# Altium project Chassis_Controller_f407zgt6.PrjPcb
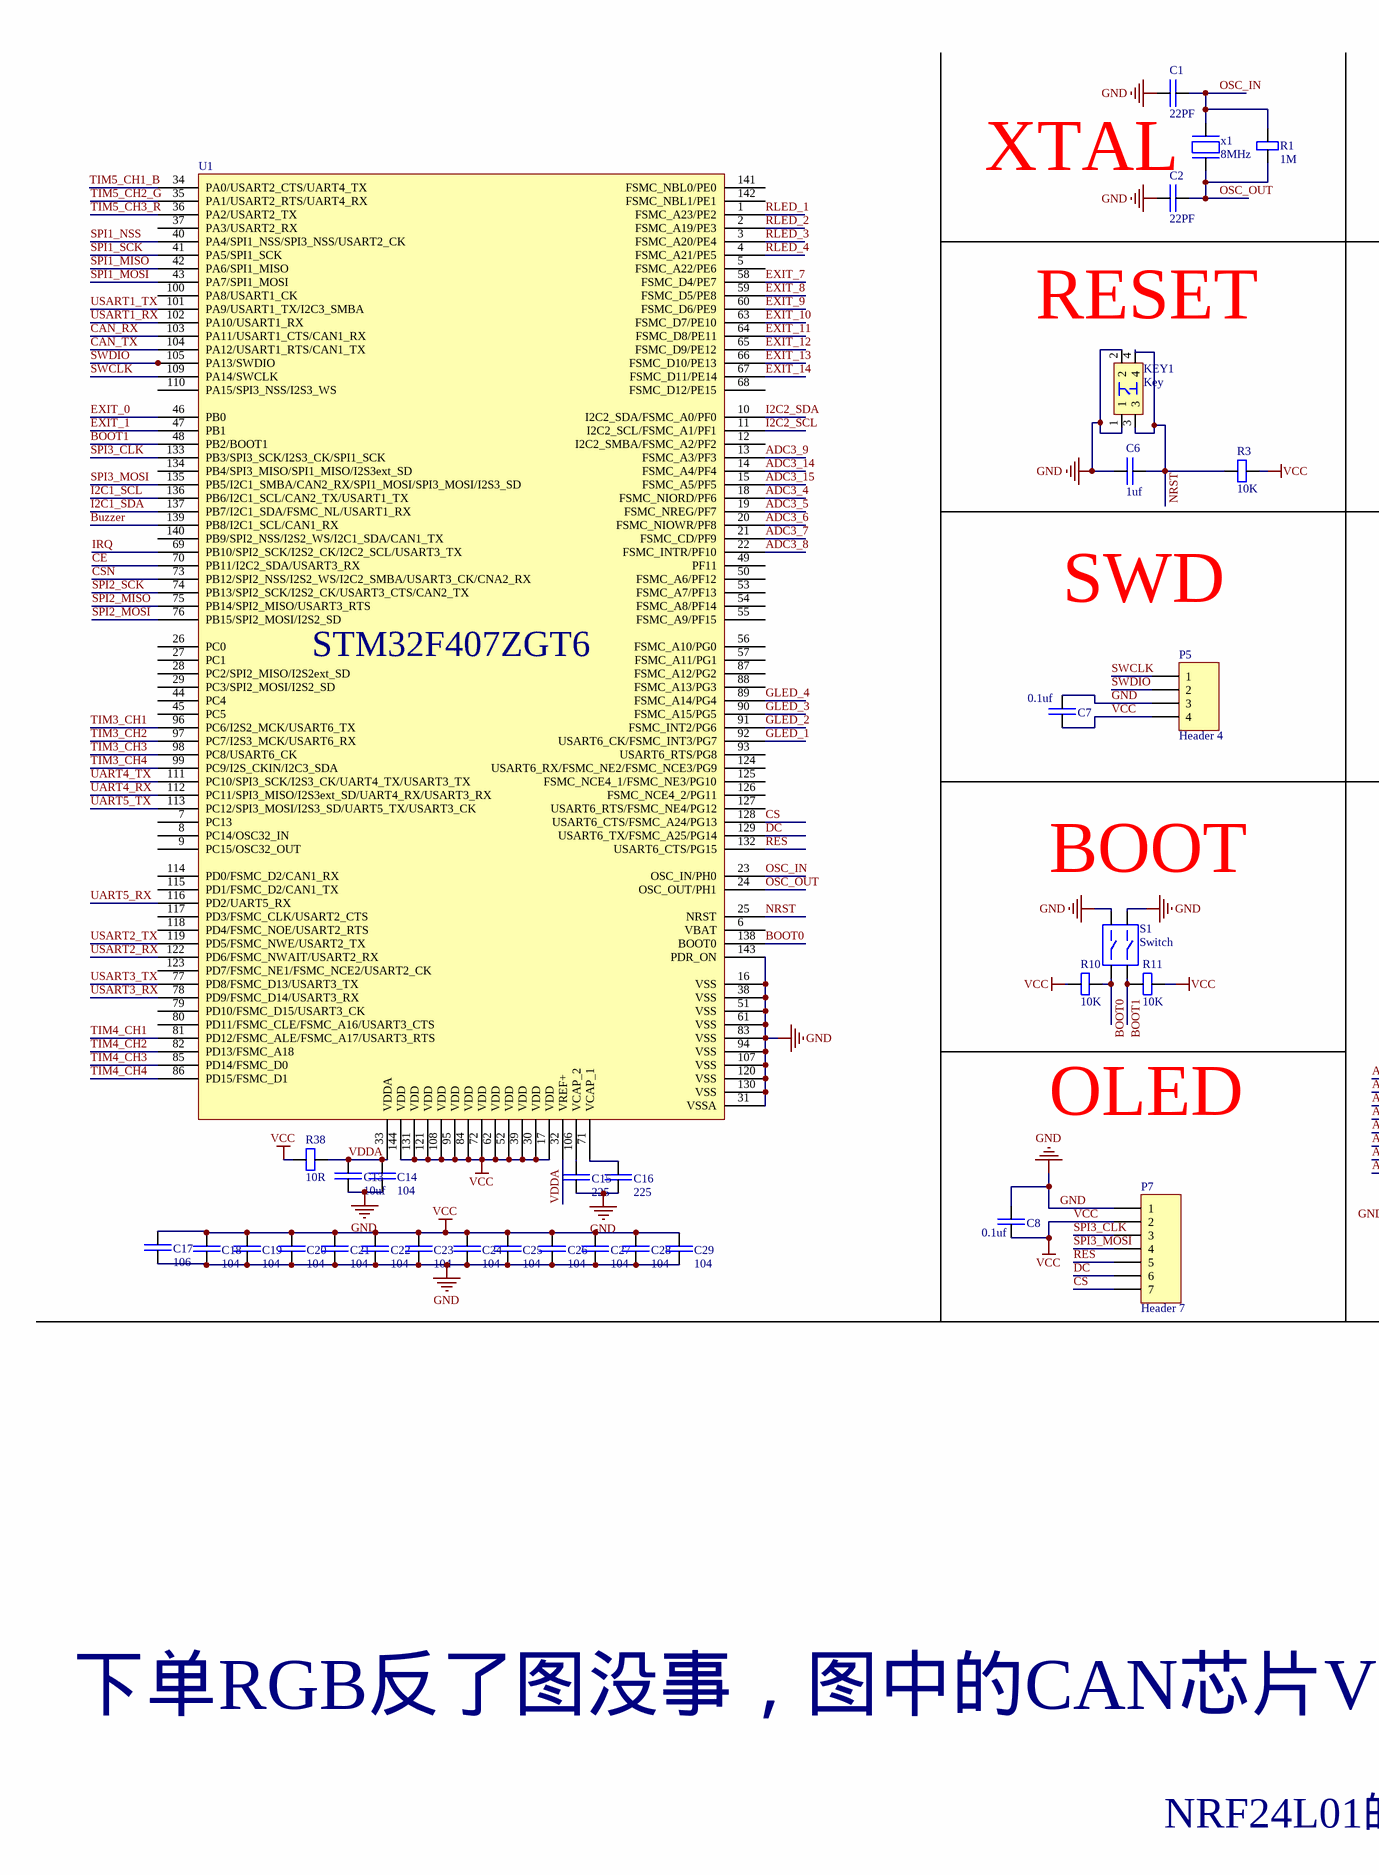
[diagram p0: Sheet1.SchDoc, left]
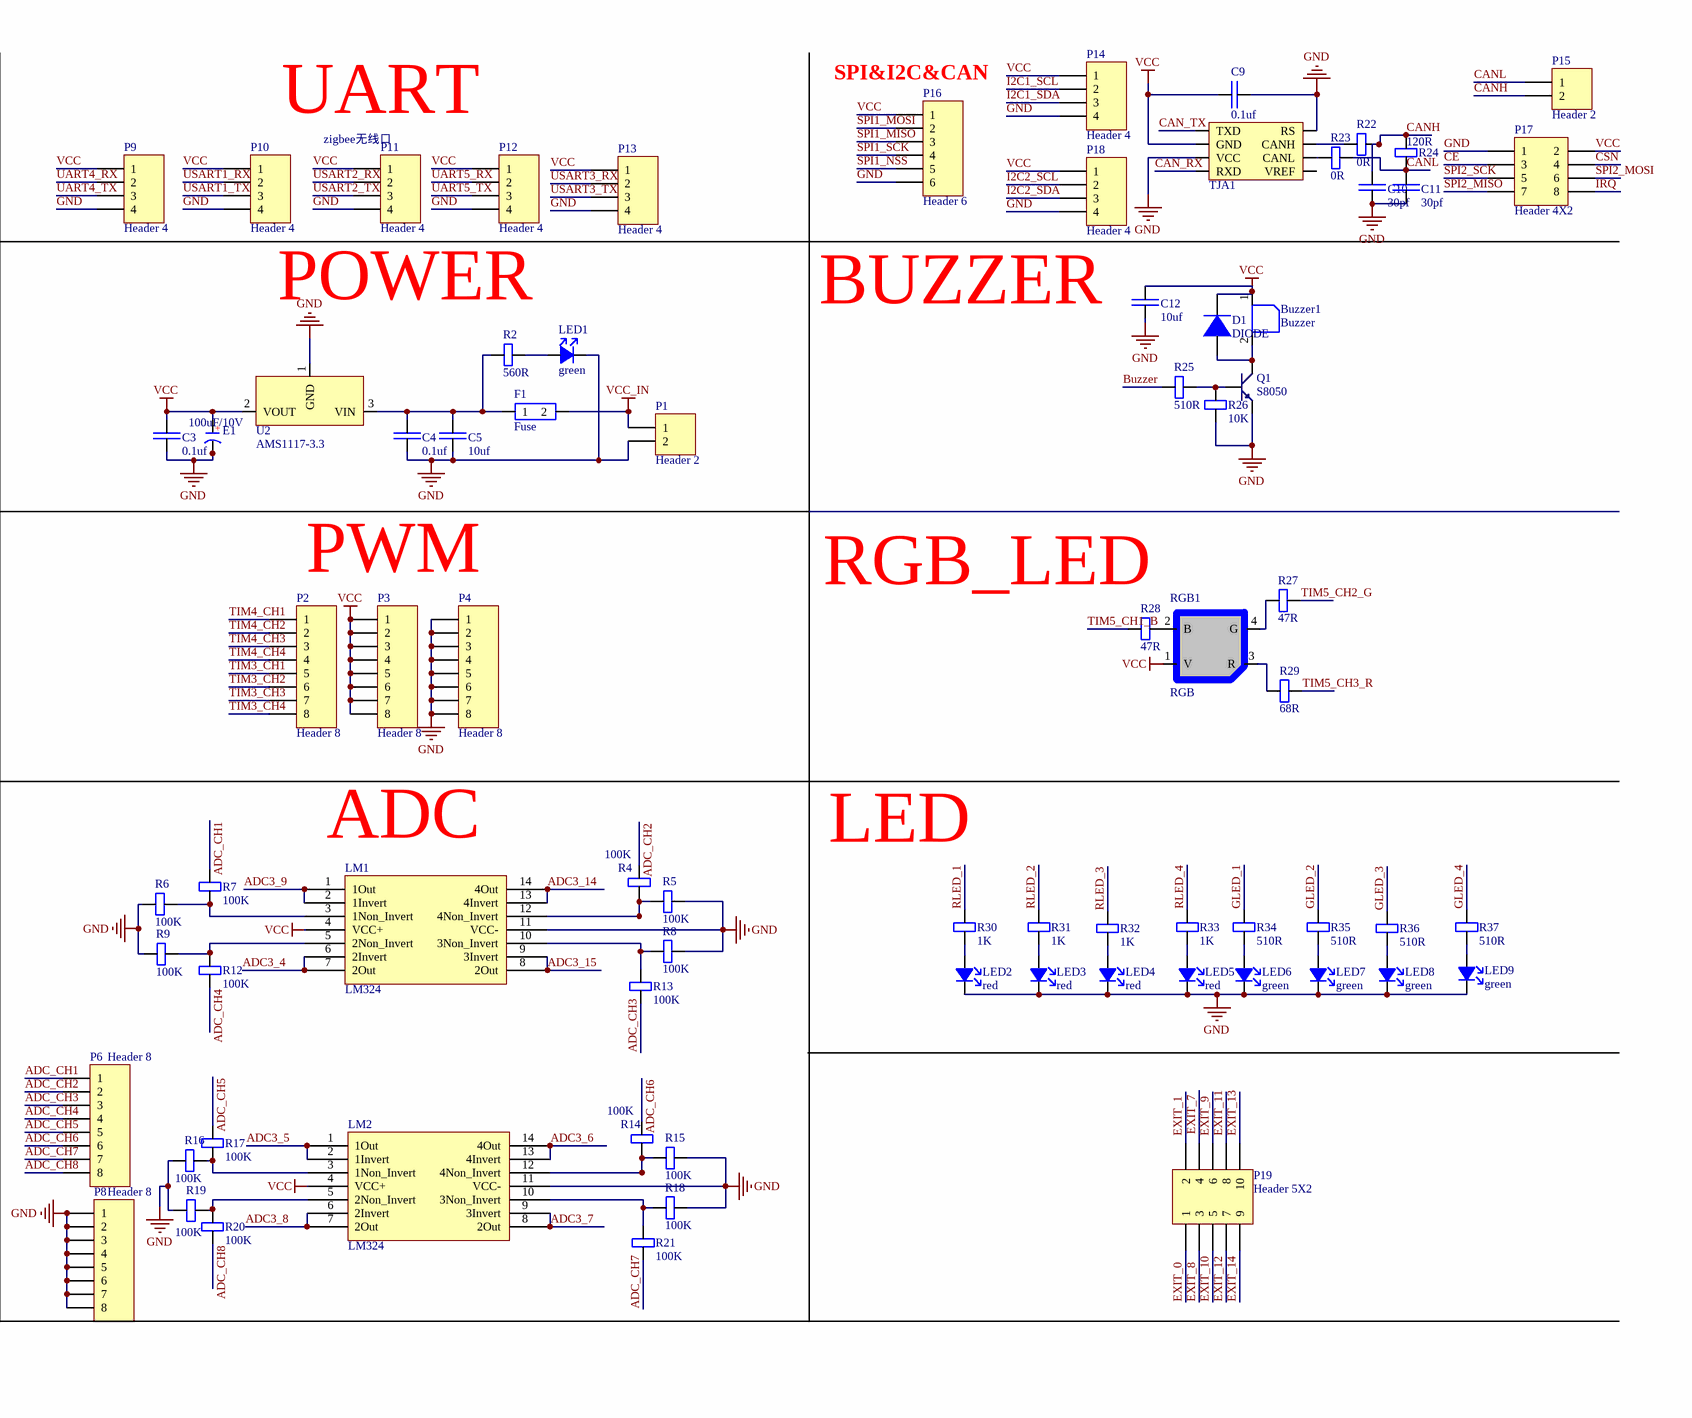
[diagram p1: Sheet1.SchDoc, right]
1 sheet, 109 parts. Net scope: global (net labels, ports and power ports of the same name join across sheets).
Board file: lined.PcbDoc

## Sheet Sheet1.SchDoc
size A2

### Parts
Buzzer1  Buzzer  [BUZZER]
C1  22PF  [0402]
C2  22PF  [0402]
C3  0.1uf  [0402]
C4  0.1uf  [0402]
C5  10uf  [0402]
C6  1uf  [0402]
C7  0.1uf  [0402]
C8  0.1uf  [0402]
C9  0.1uf  [0402]
C10  30pf  [0402]
C11  30pf  [0402]
C12  10uf  [0402]
C13  10uf  [0402]
C14  104  [0402]
C15  225  [0402]
C16  225  [0402]
C17  106  [0402]
C18  104  [0402]
C19  104  [0402]
C20  104  [0402]
C21  104  [0402]
C22  104  [0402]
C23  104  [0402]
C24  104  [0402]
C25  104  [0402]
C26  104  [0402]
C27  104  [0402]
C28  104  [0402]
C29  104  [0402]
D1  DIODE  [DIODE]
E1  100uF/10V  [3528]
F1  Fuse  [0805]
KEY1  Key  [6*6*5轻触开关]
LED1  green  [0603]
LED2  red  [0603]
LED3  red  [0603]
LED4  red  [0603]
LED5  red  [0603]
LED6  green  [0603]
LED7  green  [0603]
LED8  green  [0603]
LED9  green  [0603]
LM1  LM324  [LM324]
LM2  LM324  [LM324]
P1  Header 2  [XT30-PW-M]
P2  Header 8  [HDR1X8]
P3  Header 8  [HDR1X8]
P4  Header 8  [HDR1X8]
P5  Header 4  [GH1.25_4P]
P6  Header 8  [HDR1X8]
P7  Header 7  [HDR1X7]
P8  Header 8  [HDR1X8]
P9  Header 4  [GH1.25_4P]
P10  Header 4  [GH1.25_4P]
P11  Header 4  [GH1.25_4P]
P12  Header 4  [GH1.25_4P]
P13  Header 4  [GH1.25_4P]
P14  Header 4  [GH1.25_4P]
P15  Header 2  [GH1.25_2P]
P16  Header 6  [HDR1X6]
P17  Header 4X2  [HDR2X4]
P18  Header 4  [GH1.25_4P]
P19  Header 5X2  [HDR2X5]
Q1  S8050  [SOT-23R]
R1  1M  [0402]
R2  560R  [0402]
R3  10K  [0402]
R4  100K  [0402]
R5  100K  [0402]
R6  100K  [0402]
R7  100K  [0402]
R8  100K  [0402]
R9  100K  [0402]
R10  10K  [0402]
R11  10K  [0402]
R12  100K  [0402]
R13  100K  [0402]
R14  100K  [0402]
R15  100K  [0402]
R16  100K  [0402]
R17  100K  [0402]
R18  100K  [0402]
R19  100K  [0402]
R20  100K  [0402]
R21  100K  [0402]
R22  0R  [0402]
R23  0R  [0402]
R24  120R  [0402]
R25  510R  [0402]
R26  10K  [0402]
R27  47R  [0402]
R28  47R  [0402]
R29  68R  [0402]
R30  1K  [0402]
R31  1K  [0402]
R32  1K  [0402]
R33  1K  [0402]
R34  510R  [0402]
R35  510R  [0402]
R36  510R  [0402]
R37  510R  [0402]
R38  10R  [0402]
RGB1  RGB  [RGB_LED]
S1  Switch  [SWITCH_2P]
TJA1  TJA1050  [TJA1050]  (value not drawn)
U1  STM32F407ZGT6  [STM32F103ZETx]
U2  AMS1117-3.3  [ASM1117]
x1  8MHz  [8M晶振]

### Nets
GND: C1.2 C2.2 C3.2 C4.2 C5.2 C6.2 C7.1 C8.1 C9.2 C10.1 C11.1 C12.1 C13.1 C14.1 C15.1 C16.1 C17.1 C18.1 C19.1 C20.1 C21.1 C22.1 C23.1 C24.1 C25.1 C26.1 C27.1 C28.1 C29.1 E1.2(K) KEY1.1 KEY1.2 LED1.2 LED2.2 LED3.2 LED4.2 LED5.2 LED6.2 LED7.2 LED8.2 LED9.2 LM1.11(VCC-) LM2.11(VCC-) P1.2 P4.1 P4.2 P4.3 P4.4 P4.5 P4.6 P4.7 P4.8 P5.3 P7.1 P8.1 P8.2 P8.3 P8.4 P8.5 P8.6 P8.7 P8.8 P9.4 P10.4 P11.4 P12.4 P13.4 P14.4 P16.6 P17.1 P18.4 Q1.1(E) R5.1 R6.1 R8.1 R9.1 R15.1 R16.1 R18.1 R19.1 R26.1 S1.1 S1.3 TJA1.3(VCC) TJA1.8(RS) U1.16(VSS) U1.31(VSSA) U1.38(VSS) U1.51(VSS) U1.61(VSS) U1.83(VSS) U1.94(VSS) U1.107(VSS) U1.120(VSS) U1.130(VSS) U1.143(PDR_ON) U2.1(GND)
VCC: Buzzer1.1 C3.1 C7.2 C8.2 C9.1 C12.2 C17.2 C18.2 C19.2 C20.2 C21.2 C22.2 C23.2 C24.2 C25.2 C26.2 C27.2 C28.2 C29.2 D1.1 E1.1(A) LM1.4(VCC+) LM2.4(VCC+) P3.1 P3.2 P3.3 P3.4 P3.5 P3.6 P3.7 P3.8 P5.4 P7.2 P9.1 P10.1 P11.1 P12.1 P13.1 P14.1 P16.1 P17.2 P18.1 R3.2 R10.2 R11.1 R38.1 RGB1.1(V) TJA1.2(GND) U1.17(VDD) U1.30(VDD) U1.39(VDD) U1.52(VDD) U1.62(VDD) U1.72(VDD) U1.84(VDD) U1.95(VDD) U1.108(VDD) U1.121(VDD) U1.131(VDD) U1.144(VDD) U2.2(VOUT)
VCC_IN: F1.2 P1.1
ADC3_4: LM1.6(2Invert) LM1.7(2Out) U1.18(FSMC_NIORD/PF6)
ADC3_5: LM2.1(1Out) LM2.2(1Invert) U1.19(FSMC_NREG/PF7)
ADC3_6: LM2.13(4Invert) LM2.14(4Out) U1.20(FSMC_NIOWR/PF8)
ADC3_7: LM2.8(2Out) LM2.9(3Invert) U1.21(FSMC_CD/PF9)
ADC3_8: LM2.6(2Invert) LM2.7(2Out) U1.22(FSMC_INTR/PF10)
ADC3_9: LM1.1(1Out) LM1.2(1Invert) U1.13(FSMC_A3/PF3)
ADC3_14: LM1.13(4Invert) LM1.14(4Out) U1.14(FSMC_A4/PF4)
ADC3_15: LM1.8(2Out) LM1.9(3Invert) U1.15(FSMC_A5/PF5)
ADC_CH1: P6.1 R7.2
ADC_CH2: P6.2 R4.1
ADC_CH3: P6.3 R13.2
ADC_CH4: P6.4 R12.2
ADC_CH5: P6.5 R17.2
ADC_CH6: P6.6 R14.1
ADC_CH7: P6.7 R21.2
ADC_CH8: P6.8 R20.2
BOOT0: R10.1 S1.2 U1.138(BOOT0)
BOOT1: R11.2 S1.4 U1.48(PB2/BOOT1)
Buzzer: R25.1 U1.139(PB8/I2C1_SCL/CAN1_RX)
CAN_RX: TJA1.4(RXD) U1.103(PA11/USART1_CTS/CAN1_RX)
CAN_TX: TJA1.1(TXD) U1.104(PA12/USART1_RTS/CAN1_TX)
CANH: C10.2 P15.2 R22.2 R24.2
CANL: C11.2 P15.1 R23.2 R24.1
CE: P17.3 U1.70(PB11/I2C2_SDA/USART3_RX)
CS: P7.7 U1.128(USART6_CTS/FSMC_A24/PG13)
CSN: P17.4 U1.73(PB12/SPI2_NSS/I2S2_WS/I2C2_SMBA/USART3_CK/CNA2_RX)
DC: P7.6 U1.129(USART6_TX/FSMC_A25/PG14)
EXIT_0: P19.1 U1.46(PB0)
EXIT_1: P19.2 U1.47(PB1)
EXIT_7: P19.4 U1.58(FSMC_D4/PE7)
EXIT_8: P19.3 U1.59(FSMC_D5/PE8)
EXIT_9: P19.6 U1.60(FSMC_D6/PE9)
EXIT_10: P19.5 U1.63(FSMC_D7/PE10)
EXIT_11: P19.8 U1.64(FSMC_D8/PE11)
EXIT_12: P19.7 U1.65(FSMC_D9/PE12)
EXIT_13: P19.10 U1.66(FSMC_D10/PE13)
EXIT_14: P19.9 U1.67(FSMC_D11/PE14)
GLED_1: R34.2 U1.92(USART6_CK/FSMC_INT3/PG7)
GLED_2: R35.2 U1.91(FSMC_INT2/PG6)
GLED_3: R36.2 U1.90(FSMC_A15/PG5)
GLED_4: R37.2 U1.89(FSMC_A14/PG4)
I2C1_SCL: P14.2 U1.136(PB6/I2C1_SCL/CAN2_TX/USART1_TX)
I2C1_SDA: P14.3 U1.137(PB7/I2C1_SDA/FSMC_NL/USART1_RX)
I2C2_SCL: P18.2 U1.11(I2C2_SCL/FSMC_A1/PF1)
I2C2_SDA: P18.3 U1.10(I2C2_SDA/FSMC_A0/PF0)
IRQ: P17.8 U1.69(PB10/SPI2_SCK/I2S2_CK/I2C2_SCL/USART3_TX)
NRST: C6.1 KEY1.3 KEY1.4 R3.1 U1.25(NRST)
OSC_IN: C1.1 R1.2 U1.23(OSC_IN/PH0) x1.1
OSC_OUT: C2.1 R1.1 U1.24(OSC_OUT/PH1) x1.2
RES: P7.5 U1.132(USART6_CTS/PG15)
RLED_1: R30.2 U1.1(FSMC_A23/PE2)
RLED_2: R31.2 U1.2(FSMC_A19/PE3)
RLED_3: R32.2 U1.3(FSMC_A20/PE4)
RLED_4: R33.2 U1.4(FSMC_A21/PE5)
SPI1_MISO: P16.3 U1.42(PA6/SPI1_MISO)
SPI1_MOSI: P16.2 U1.43(PA7/SPI1_MOSI)
SPI1_NSS: P16.5 U1.40(PA4/SPI1_NSS/SPI3_NSS/USART2_CK)
SPI1_SCK: P16.4 U1.41(PA5/SPI1_SCK)
SPI2_MISO: P17.7 U1.75(PB14/SPI2_MISO/USART3_RTS)
SPI2_MOSI: P17.6 U1.76(PB15/SPI2_MOSI/I2S2_SD)
SPI2_SCK: P17.5 U1.74(PB13/SPI2_SCK/I2S2_CK/USART3_CTS/CAN2_TX)
SPI3_CLK: P7.3 U1.133(PB3/SPI3_SCK/I2S3_CK/SPI1_SCK)
SPI3_MOSI: P7.4 U1.135(PB5/I2C1_SMBA/CAN2_RX/SPI1_MOSI/SPI3_MOSI/I2S3_SD)
SWCLK: P5.1 U1.109(PA14/SWCLK)
SWDIO: P5.2 U1.105(PA13/SWDIO)
TIM3_CH1: P2.5 U1.96(PC6/I2S2_MCK/USART6_TX)
TIM3_CH2: P2.6 U1.97(PC7/I2S3_MCK/USART6_RX)
TIM3_CH3: P2.7 U1.98(PC8/USART6_CK)
TIM3_CH4: P2.8 U1.99(PC9/I2S_CKIN/I2C3_SDA)
TIM4_CH1: P2.1 U1.81(PD12/FSMC_ALE/FSMC_A17/USART3_RTS)
TIM4_CH2: P2.2 U1.82(PD13/FSMC_A18)
TIM4_CH3: P2.3 U1.85(PD14/FSMC_D0)
TIM4_CH4: P2.4 U1.86(PD15/FSMC_D1)
TIM5_CH1_B: R28.2 U1.34(PA0/USART2_CTS/UART4_TX)
TIM5_CH2_G: R27.1 U1.35(PA1/USART2_RTS/UART4_RX)
TIM5_CH3_R: R29.1 U1.36(PA2/USART2_TX)
UART4_RX: P9.2 U1.112(PC11/SPI3_MISO/I2S3ext_SD/UART4_RX/USART3_RX)
UART4_TX: P9.3 U1.111(PC10/SPI3_SCK/I2S3_CK/UART4_TX/USART3_TX)
UART5_RX: P12.2 U1.116(PD2/UART5_RX)
UART5_TX: P12.3 U1.113(PC12/SPI3_MOSI/I2S3_SD/UART5_TX/USART3_CK)
USART1_RX: P10.2 U1.102(PA10/USART1_RX)
USART1_TX: P10.3 U1.101(PA9/USART1_TX/I2C3_SMBA)
USART2_RX: P11.2 U1.122(PD6/FSMC_NWAIT/USART2_RX)
USART2_TX: P11.3 U1.119(PD5/FSMC_NWE/USART2_TX)
USART3_RX: P13.2 U1.78(PD9/FSMC_D14/USART3_RX)
USART3_TX: P13.3 U1.77(PD8/FSMC_D13/USART3_TX)
VDDA: C13.2 C14.2 R38.2 U1.32(VREF+) U1.33(VDDA)
NetBuzzer1_2: Buzzer1.2 D1.2 Q1.3(C)
NetC4_1: C4.1 C5.1 F1.1 R2.1 U2.3(VIN)
NetC15_2: C15.2 U1.106(VCAP_2)
NetC16_2: C16.2 U1.71(VCAP_1)
NetLED1_1: LED1.1 R2.2
NetLED2_1: LED2.1 R30.1
NetLED3_1: LED3.1 R31.1
NetLED4_1: LED4.1 R32.1
NetLED5_1: LED5.1 R33.1
NetLED6_1: LED6.1 R34.1
NetLED7_1: LED7.1 R35.1
NetLED8_1: LED8.1 R36.1
NetLED9_1: LED9.1 R37.1
NetLM1_3: LM1.3(1Non_Invert) R6.2 R7.1
NetLM1_5: LM1.5(2Non_Invert) R9.2 R12.1
NetLM1_10: LM1.10(3Non_Invert) R8.2 R13.1
NetLM1_12: LM1.12(4Non_Invert) R4.2 R5.2
NetLM2_3: LM2.3(1Non_Invert) R16.2 R17.1
NetLM2_5: LM2.5(2Non_Invert) R19.2 R20.1
NetLM2_10: LM2.10(3Non_Invert) R18.2 R21.1
NetLM2_12: LM2.12(4Non_Invert) R14.2 R15.2
NetQ1_2: Q1.2(B) R25.2 R26.2
NetR22_1: R22.1 TJA1.7(CANH)
NetR23_1: R23.1 TJA1.6(CANL)
NetR27_2: R27.2 RGB1.4(G)
NetR28_1: R28.1 RGB1.2(B)
NetR29_2: R29.2 RGB1.3(R)

Not connected (* = marked no-connect by the designer): TJA1 5(VREF); U1 5(FSMC_A22/PE6) 6(VBAT) 7(PC13) 8(PC14/OSC32_IN) 9(PC15/OSC32_OUT) 12(I2C2_SMBA/FSMC_A2/PF2) 26(PC0) 27(PC1) 28(PC2/SPI2_MISO/I2S2ext_SD) 29(PC3/SPI2_MOSI/I2S2_SD) 37(PA3/USART2_RX) 44(PC4) 45(PC5) 49(PF11) 50(FSMC_A6/PF12) 53(FSMC_A7/PF13) 54(FSMC_A8/PF14) 55(FSMC_A9/PF15) 56(FSMC_A10/PG0) 57(FSMC_A11/PG1) 68(FSMC_D12/PE15) 79(PD10/FSMC_D15/USART3_CK) 80(PD11/FSMC_CLE/FSMC_A16/USART3_CTS) 87(FSMC_A12/PG2) 88(FSMC_A13/PG3) 93(USART6_RTS/PG8) 100(PA8/USART1_CK) 110(PA15/SPI3_NSS/I2S3_WS) 114(PD0/FSMC_D2/CAN1_RX) 115(PD1/FSMC_D2/CAN1_TX) 117(PD3/FSMC_CLK/USART2_CTS) 118(PD4/FSMC_NOE/USART2_RTS) 123(PD7/FSMC_NE1/FSMC_NCE2/USART2_CK) 124(USART6_RX/FSMC_NE2/FSMC_NCE3/PG9) 125(FSMC_NCE4_1/FSMC_NE3/PG10) 126(FSMC_NCE4_2/PG11) 127(USART6_RTS/FSMC_NE4/PG12) 134(PB4/SPI3_MISO/SPI1_MISO/I2S3ext_SD) 140(PB9/SPI2_NSS/I2S2_WS/I2C1_SDA/CAN1_TX) 141(FSMC_NBL0/PE0) 142(FSMC_NBL1/PE1)

### Notes on the sheet
- UART
- (near P16) SPI&I2C&CAN
- XTAL
- (near P11) zigbee无线口
- (near KEY1) RESET
- POWER
- BUZZER
- PWM
- RGB_LED
- SWD
- (near LM1) ADC
- LED
- (near S1) BOOT
- OLED
- 下单RGB反了图没事，图中的CAN芯片VCC和GND反了。而且XT30的PCB封装出错了
- NRF24L01的8个脚反了180°
- (in symbol C-CM) +

### Library data of the parts
C1-C29 = C
E1 = C-CM: 钽电容; BOM名称: 贴片电解电容; 版权归属: 源创客; 学习资源: www.ooocke.com
LED1-LED9 = LED
P1 P15 = Header 2: Header, 2-Pin; LatestRevisionDate: 17-Jul-2002; LatestRevisionNote: Re-released for DXP Platform.; Publisher: Altium Limited
P2-P4 P6 P8 = Header 8: Header, 8-Pin; LatestRevisionDate: 17-Jul-2002; LatestRevisionNote: Re-released for DXP Platform.; Publisher: Altium Limited
P5 P9-P14 P18 = Header 4: Header, 4-Pin; LatestRevisionDate: 17-Jul-2002; LatestRevisionNote: Re-released for DXP Platform.; Publisher: Altium Limited
P7 = Header 7: Header, 7-Pin; LatestRevisionDate: 17-Jul-2002; LatestRevisionNote: Re-released for DXP Platform.; Publisher: Altium Limited
P16 = Header 6: Header, 6-Pin; LatestRevisionDate: 17-Jul-2002; LatestRevisionNote: Re-released for DXP Platform.; Publisher: Altium Limited
P17 = Header 4X2: Header, 4-Pin, Dual row; LatestRevisionDate: 17-Jul-2002; LatestRevisionNote: Re-released for DXP Platform.; Publisher: Altium Limited
P19 = Header 5X2: Header, 5-Pin, Dual row; LatestRevisionDate: 17-Jul-2002; LatestRevisionNote: Re-released for DXP Platform.; Publisher: Altium Limited
Q1 = NPN: 8050/BCW846/BCW847
R1-R38 = R
x1 = XTAL_8MHz